# EAGLE schematic schematic (EAGLE 9.6.2)
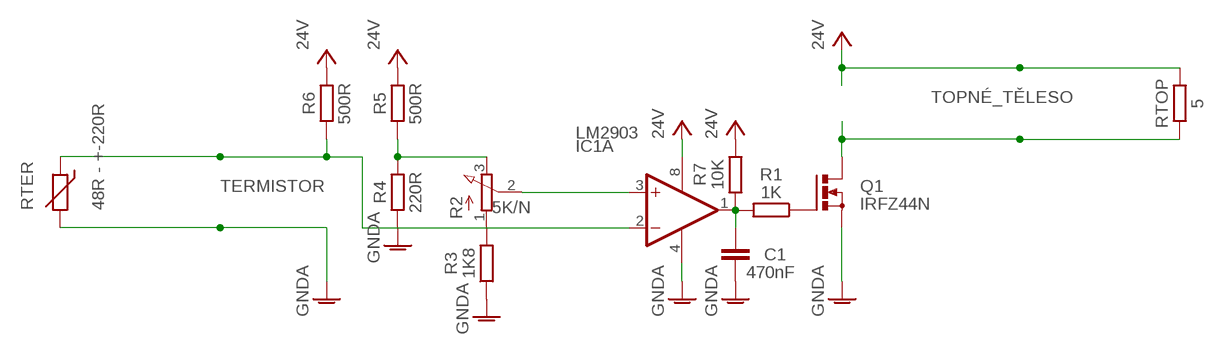
[diagram p0: schematic, sheet 1]

## Parts
C1  470nF  C2.5/2  [C2.5-2]
IC1  LM2903  LM358N  [DIL08]
Q1  IRFZ44N  PMOSFET_NTO220BH  [TO220BH]
R1  1K  R_AXIAL-7.2MM-PITCH  [RESAD724W46L381D178B]
R2  5K/N  3RP/1610N  [3RP/1610N]
R3  1K8  R_AXIAL-7.2MM-PITCH  [RESAD724W46L381D178B]
R4  220R  R_AXIAL-7.2MM-PITCH  [RESAD724W46L381D178B]
R5  500R  R_AXIAL-7.2MM-PITCH  [RESAD724W46L381D178B]
R6  500R  R_AXIAL-7.2MM-PITCH  [RESAD724W46L381D178B]
R7  10K  R_AXIAL-7.2MM-PITCH  [RESAD724W46L381D178B]
RTER  48R - +-220R  THERMISTOR-2,5  [RS-2,5]
RTOP  5  R_AXIAL-7.2MM-PITCH  [RESAD724W46L381D178B]

## Nets
GNDA: C1.2 IC1.4(P:V-) Q1.S R3.1 R4.1 RTER.2
N$1: R2.1(A) R3.2
N$2: R2.3(E) R4.2 R5.1
N$3: IC1.3(A:+IN) R2.2(S)
N$4: C1.1 IC1.1(A:OUT) R1.2 R7.2
N$5: Q1.G R1.1
TERMISTOR: IC1.2(A:-IN) R6.1 RTER.1
TOPNÉ_TĚLESO: Q1.D RTOP.1
VCC: IC1.8(P:V+) R5.2 R6.2 R7.1 RTOP.2 ; supply symbol labelled 24V
Unconnected: IC1.5(B:+IN) IC1.6(B:-IN) IC1.7(B:OUT)

## Library data of the parts
C1 = capacitor-wima:C: CAPACITOR naming: grid - package width
IC1 = linear:LM358: OP AMP also LM158; LM258; LM2904 Source: http://cache.national.com/ds/LM/LM158.pdf
Q1 = transistor-power:PMOSFET_N: Power MOSFET N-Channel; SPICEPREFIX: M
R1 R3-R7 RTOP = Resistor:R: Resistor Fixed - Generic; CATEGORY: Resistor; SPICEPREFIX: R; SUB-CATEGORY: Fixed
R2 = pot:3RP/1610N: 16mm Potentiometer one level Source: http://www.alphapotentiometers.net/html/16mm_pot_2.html; SPICEPREFIX: J
RTER = varistor:THERMISTOR: THERMISTOR